# Altium schematic sheet ADC.SchDoc
size A3
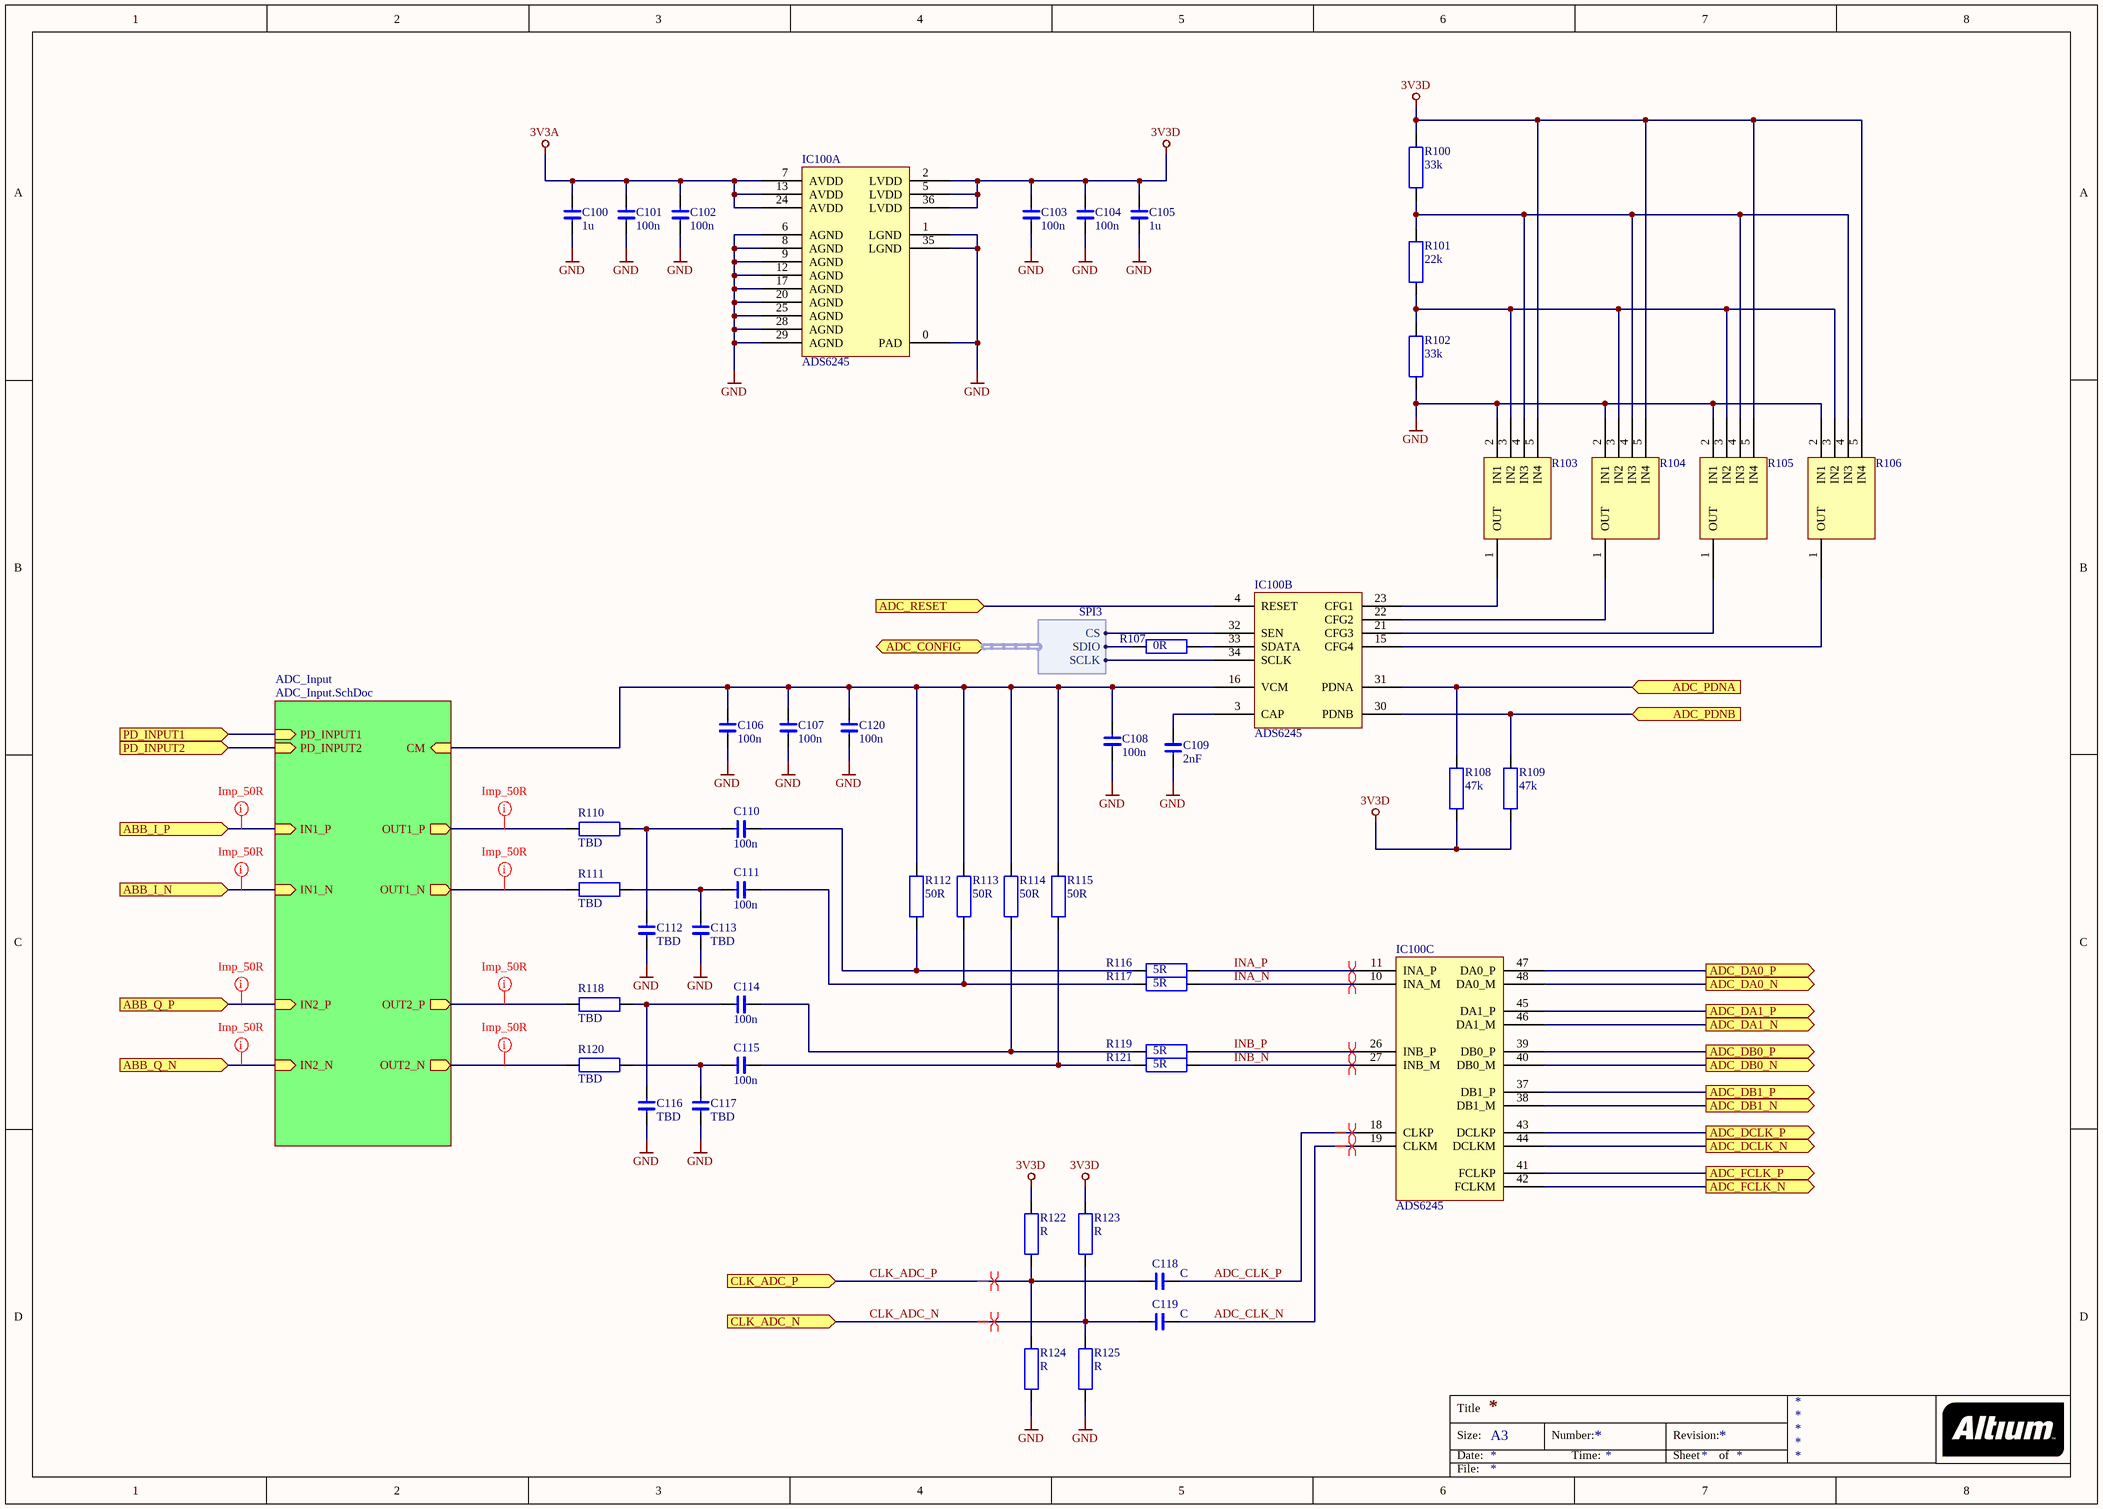
[diagram p0: ADC.SchDoc]

## Parts
C100  1u  [0603 SMALL OUTLINE]
C101  100n  [0603 SMALL OUTLINE]
C102  100n  [0603 SMALL OUTLINE]
C103  100n  [0603 SMALL OUTLINE]
C104  100n  [0603 SMALL OUTLINE]
C105  1u  [0603 SMALL OUTLINE]
C106  100n  [0603 SMALL OUTLINE]
C107  100n  [0603 SMALL OUTLINE]
C108  100n  [0603 SMALL OUTLINE]
C109  2nF  [0603 SMALL OUTLINE]
C110  100n  [0603 SMALL OUTLINE]
C111  100n  [0603 SMALL OUTLINE]
C112  TBD  [0603 SMALL OUTLINE]
C113  TBD  [0603 SMALL OUTLINE]
C114  100n  [0603 SMALL OUTLINE]
C115  100n  [0603 SMALL OUTLINE]
C116  TBD  [0603 SMALL OUTLINE]
C117  TBD  [0603 SMALL OUTLINE]
C118  C  [0603 SMALL OUTLINE]
C119  C  [0603 SMALL OUTLINE]
C120  100n  [0603 SMALL OUTLINE]
IC100  ADS6245  [VQFN48_LONG]  (parts A,B,C of 3)
R100  33k  [0603 SMALL OUTLINE]
R101  22k  [0603 SMALL OUTLINE]
R102  33k  [0603 SMALL OUTLINE]
R103  0603_MUX4  [0603_MUX4]  (value not drawn)
R104  0603_MUX4  [0603_MUX4]  (value not drawn)
R105  0603_MUX4  [0603_MUX4]  (value not drawn)
R106  0603_MUX4  [0603_MUX4]  (value not drawn)
R107  0R  [0603 SMALL OUTLINE]
R108  47k  [0603 SMALL OUTLINE]
R109  47k  [0603 SMALL OUTLINE]
R110  TBD  [0603 SMALL OUTLINE]
R111  TBD  [0603 SMALL OUTLINE]
R112  50R  [0603 SMALL OUTLINE]
R113  50R  [0603 SMALL OUTLINE]
R114  50R  [0603 SMALL OUTLINE]
R115  50R  [0603 SMALL OUTLINE]
R116  5R  [0603 SMALL OUTLINE]
R117  5R  [0603 SMALL OUTLINE]
R118  TBD  [0603 SMALL OUTLINE]
R119  5R  [0603 SMALL OUTLINE]
R120  TBD  [0603 SMALL OUTLINE]
R121  5R  [0603 SMALL OUTLINE]
R122  R  [0603 SMALL OUTLINE]
R123  R  [0603 SMALL OUTLINE]
R124  R  [0603 SMALL OUTLINE]
R125  R  [0603 SMALL OUTLINE]

## Sub-sheets
ADC_Input = ADC_Input.SchDoc: CM (in), IN1_P (in), IN1_N (in), OUT1_P (out), OUT1_N (out), IN2_P (in), IN2_N (in), OUT2_P (out), OUT2_N (out), PD_INPUT1 (in), PD_INPUT2 (in)

## Ports
ABB_I_N (in), ABB_I_P (in), ABB_Q_N (in), ABB_Q_P (in), ADC_CONFIG (harness SPI3), ADC_DA0_N (out), ADC_DA0_P (out), ADC_DA1_N (out), ADC_DA1_P (out), ADC_DB0_N (out), ADC_DB0_P (out), ADC_DB1_N (out), ADC_DB1_P (out), ADC_DCLK_N (out), ADC_DCLK_P (out), ADC_FCLK_N (out), ADC_FCLK_P (out), ADC_PDNA (in), ADC_PDNB (in), ADC_RESET (in), CLK_ADC_N (in), CLK_ADC_P (in), PD_INPUT1 (in), PD_INPUT2 (in)

## Harnesses
SPI3: CS, SCLK, SDIO

## Nets
3V3A: C100.1 C101.1 C102.1 IC100.7(AVDD) IC100.13(AVDD) IC100.24(AVDD)
3V3D: C103.1 C104.1 C105.1 IC100.2(LVDD) IC100.5(LVDD) IC100.36(LVDD) R100.2 R103.5(IN4) R104.5(IN4) R105.5(IN4) R106.5(IN4) R108.1 R109.1 R122.1 R123.1
GND: C100.2 C101.2 C102.2 C103.2 C104.2 C105.2 C106.2 C107.2 C108.2 C109.2 C112.2 C113.2 C116.2 C117.2 C120.2 IC100.0(PAD) IC100.1(LGND) IC100.6(AGND) IC100.8(AGND) IC100.9(AGND) IC100.12(AGND) IC100.17(AGND) IC100.20(AGND) IC100.25(AGND) IC100.28(AGND) IC100.29(AGND) IC100.35(LGND) R102.1 R103.2(IN1) R104.2(IN1) R105.2(IN1) R106.2(IN1) R124.2 R125.2
ABB_I_N: port ABB_I_N, sheet ADC_Input/IN1_N
ABB_I_P: port ABB_I_P, sheet ADC_Input/IN1_P
ABB_Q_N: port ABB_Q_N, sheet ADC_Input/IN2_N
ABB_Q_P: port ABB_Q_P, sheet ADC_Input/IN2_P
ADC_CLK_N: C119.2 IC100.19(CLKM)
ADC_CLK_P: C118.2 IC100.18(CLKP)
ADC_DA0_N: IC100.48(DA0_M) ; port ADC_DA0_N
ADC_DA0_P: IC100.47(DA0_P) ; port ADC_DA0_P
ADC_DA1_N: IC100.46(DA1_M) ; port ADC_DA1_N
ADC_DA1_P: IC100.45(DA1_P) ; port ADC_DA1_P
ADC_DB0_N: IC100.40(DB0_M) ; port ADC_DB0_N
ADC_DB0_P: IC100.39(DB0_P) ; port ADC_DB0_P
ADC_DB1_N: IC100.38(DB1_M) ; port ADC_DB1_N
ADC_DB1_P: IC100.37(DB1_P) ; port ADC_DB1_P
ADC_DCLK_N: IC100.44(DCLKM) ; port ADC_DCLK_N
ADC_DCLK_P: IC100.43(DCLKP) ; port ADC_DCLK_P
ADC_FCLK_N: IC100.42(FCLKM) ; port ADC_FCLK_N
ADC_FCLK_P: IC100.41(FCLKP) ; port ADC_FCLK_P
ADC_PDNA: IC100.31(PDNA) R108.2 ; port ADC_PDNA
ADC_PDNB: IC100.30(PDNB) R109.2 ; port ADC_PDNB
ADC_RESET: IC100.4(RESET) ; port ADC_RESET
CLK_ADC_N: C119.1 R123.2 R125.1 ; port CLK_ADC_N
CLK_ADC_P: C118.1 R122.2 R124.1 ; port CLK_ADC_P
INA_N: IC100.10(INA_M) R117.2
INA_P: IC100.11(INA_P) R116.2
INB_N: IC100.27(INB_M) R121.2
INB_P: IC100.26(INB_P) R119.2
PD_INPUT1: port PD_INPUT1, sheet ADC_Input/PD_INPUT1
PD_INPUT2: port PD_INPUT2, sheet ADC_Input/PD_INPUT2
NetC106_1: C106.1 C107.1 C108.1 C120.1 IC100.16(VCM) R112.1 R113.1 R114.1 R115.1 ; sheet ADC_Input/CM
NetC109_1: C109.1 IC100.3(CAP)
NetC110_1: C110.1 R112.2 R116.1
NetC110_2: C110.2 C112.1 R110.1
NetC111_1: C111.1 R113.2 R117.1
NetC111_2: C111.2 C113.1 R111.1
NetC114_1: C114.1 R114.2 R119.1
NetC114_2: C114.2 C116.1 R118.1
NetC115_1: C115.1 R115.2 R121.1
NetC115_2: C115.2 C117.1 R120.1
NetIC100_15: IC100.15(CFG4) R106.1(OUT)
NetIC100_21: IC100.21(CFG3) R105.1(OUT)
NetIC100_22: IC100.22(CFG2) R104.1(OUT)
NetIC100_23: IC100.23(CFG1) R103.1(OUT)
NetIC100_32: IC100.32(SEN) ; port ADC_CONFIG.CS
NetIC100_33: IC100.33(SDATA) R107.2
NetIC100_34: IC100.34(SCLK) ; port ADC_CONFIG.SCLK
NetR100_1: R100.1 R101.2 R103.4(IN3) R104.4(IN3) R105.4(IN3) R106.4(IN3)
NetR101_1: R101.1 R102.2 R103.3(IN2) R104.3(IN2) R105.3(IN2) R106.3(IN2)
NetR107_1: R107.1 ; port ADC_CONFIG.SDIO
NetR110_2: R110.2 ; sheet ADC_Input/OUT1_P
NetR111_2: R111.2 ; sheet ADC_Input/OUT1_N
NetR118_2: R118.2 ; sheet ADC_Input/OUT2_P
NetR120_2: R120.2 ; sheet ADC_Input/OUT2_N

## Layout directives
differential pair: ADC_CLK_N, ADC_CLK_P, CLK_ADC_N, CLK_ADC_P, INA_N, INA_P, INB_N, INB_P
net class Imp_50R: ABB_I_N, ABB_I_P, ABB_Q_N, ABB_Q_P, NetR110_2, NetR111_2, NetR118_2, NetR120_2

## Notes on the sheet
- Title
- Size:
- Date:
- A3
- Number:
- Time:
- Revision:
- Sheet
- of
- File:

## Library data of the parts
C100-C117 C120 = C
IC100 = ADS6245_2WIRE: DUAL CHANNEL, 14-BIT, 125/105/80/65 MSPS ADC WITH SERIAL LVDS OUTPUTS
R100-R102 R107-R121 = R